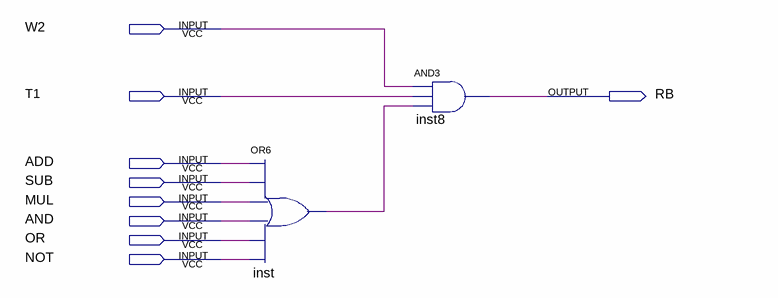
[diagram p0: schematic sheet]
// Quartus schematic RB.bdf as structural Verilog: 2 symbols, 9 pins
module RB (
  input  W2,
  input  T1,
  input  ADD,
  input  SUB,
  input  MUL,
  input  AND,
  input  OR,
  input  NOT,
  output RB
);

  wire inst_out;

  or inst (inst_out, ADD, SUB, MUL, AND, OR, NOT);
  and inst8 (RB, W2, T1, inst_out);
endmodule
